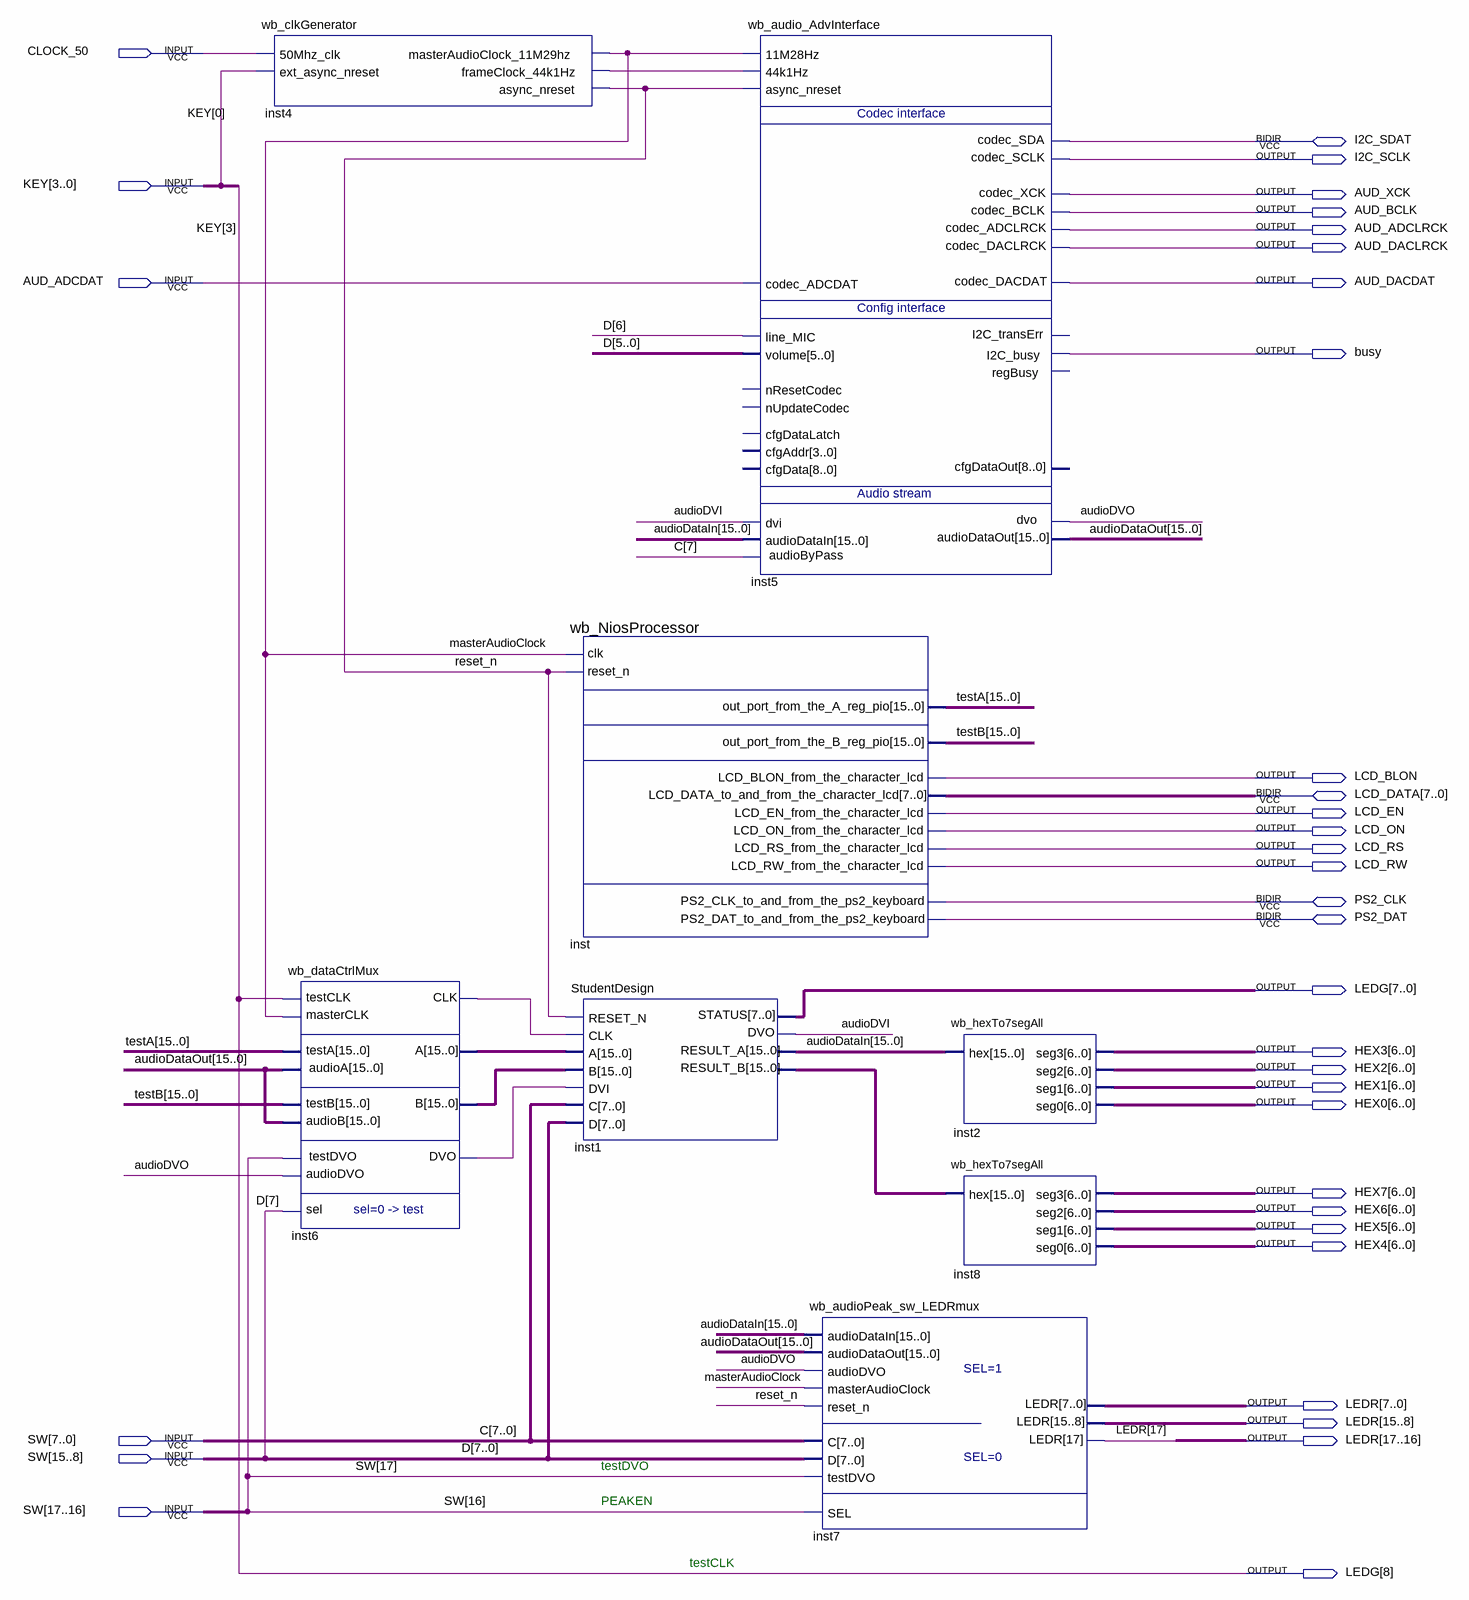
[diagram p0: schematic sheet]
// Quartus schematic Lab4.bdf as structural Verilog: 8 symbols, 35 pins
module Lab4 (
  input  CLOCK_50,
  input  [3:0] KEY,
  input  AUD_ADCDAT,
  input  [17:0] SW,
  inout  I2C_SDAT,
  inout  [7:0] LCD_DATA,
  inout  PS2_CLK,
  inout  PS2_DAT,
  output I2C_SCLK,
  output AUD_XCK,
  output AUD_BCLK,
  output AUD_ADCLRCK,
  output AUD_DACLRCK,
  output AUD_DACDAT,
  output busy,
  output LCD_BLON,
  output LCD_EN,
  output LCD_ON,
  output LCD_RS,
  output LCD_RW,
  output [8:0] LEDG,
  output [6:0] HEX3,
  output [6:0] HEX2,
  output [6:0] HEX1,
  output [6:0] HEX0,
  output [6:0] HEX7,
  output [6:0] HEX6,
  output [6:0] HEX5,
  output [6:0] HEX4,
  output [17:0] LEDR
);

  wire audioDVI, audioDVO, inst4_frameclock_44k1hz, inst6_clk, inst6_dvo, masterAudioClock, reset_n;
  wire [15:0] audioDataIn, audioDataOut, inst1_result_b, inst6_a, inst6_b, testA, testB;

  wb_clkGenerator inst4 (
    .\50Mhz_clk (CLOCK_50), .ext_async_nreset(KEY[0]), .frameClock_44k1Hz(inst4_frameclock_44k1hz),
    .masterAudioClock_11M29hz(masterAudioClock), .async_nreset(reset_n));
  wb_dataCtrlMux inst6 (
    .masterCLK(masterAudioClock), .audioA(audioDataOut), .testA(testA), .audioB(audioDataOut), .testB(testB),
    .testDVO(SW[17]), .sel(SW[15]), .testCLK(KEY[3]), .audioDVO(audioDVO), .CLK(inst6_clk), .A(inst6_a),
    .B(inst6_b), .DVO(inst6_dvo));
  wb_NiosProcessor inst (
    .clk(masterAudioClock), .reset_n(reset_n), .out_port_from_the_A_reg_pio(testA),
    .out_port_from_the_B_reg_pio(testB), .LCD_BLON_from_the_character_lcd(LCD_BLON),
    .LCD_EN_from_the_character_lcd(LCD_EN), .LCD_ON_from_the_character_lcd(LCD_ON),
    .LCD_RS_from_the_character_lcd(LCD_RS), .LCD_RW_from_the_character_lcd(LCD_RW),
    .LCD_DATA_to_and_from_the_character_lcd(LCD_DATA), .PS2_CLK_to_and_from_the_ps2_keyboard(PS2_CLK),
    .PS2_DAT_to_and_from_the_ps2_keyboard(PS2_DAT));
  StudentDesign inst1 (
    .A(inst6_a), .B(inst6_b), .C(SW[7:0]), .D(SW[15:8]), .CLK(inst6_clk), .RESET_N(reset_n), .DVI(inst6_dvo),
    .RESULT_A(audioDataIn), .RESULT_B(inst1_result_b), .STATUS(LEDG[7:0]), .DVO(audioDVI));
  wb_audio_AdvInterface inst5 (
    .\11M28Hz (masterAudioClock), .\44k1Hz (inst4_frameclock_44k1hz), .async_nreset(reset_n),
    .codec_ADCDAT(AUD_ADCDAT), .line_MIC(SW[14]), .volume(SW[13:8]), .dvi(audioDVI),
    .audioDataIn(audioDataIn), .audioByPass(SW[7]), .codec_XCK(AUD_XCK), .codec_SDA(I2C_SDAT),
    .codec_SCLK(I2C_SCLK), .codec_BCLK(AUD_BCLK), .codec_ADCLRCK(AUD_ADCLRCK), .codec_DACLRCK(AUD_DACLRCK),
    .codec_DACDAT(AUD_DACDAT), .I2C_busy(busy), .dvo(audioDVO), .audioDataOut(audioDataOut));  // open: nResetCodec, nUpdateCodec, cfgDataLatch, cfgAddr, cfgData, I2C_transErr, regBusy, cfgDataOut
  wb_audioPeak_sw_LEDRmux inst7 (
    .audioDataIn(audioDataIn), .audioDataOut(audioDataOut), .masterAudioClock(masterAudioClock),
    .reset_n(reset_n), .C(SW[7:0]), .D(SW[15:8]), .testDVO(SW[17]), .SEL(SW[16]), .audioDVO(audioDVO),
    .LEDR({LEDR[17], LEDR[15:0]}));
  wb_hexTo7segAll inst2 (.hex(audioDataIn), .seg3(HEX3), .seg2(HEX2), .seg1(HEX1), .seg0(HEX0));
  wb_hexTo7segAll inst8 (.hex(inst1_result_b), .seg3(HEX7), .seg2(HEX6), .seg1(HEX5), .seg0(HEX4));

  assign LEDG[8] = KEY[3];

  // Other names for the same wires on the sheet: C[7:0] = SW[7:0]; D[7:0] = SW[15:8]

  // Notes on the sheet:
  //   testDVO
  //   PEAKEN
  //   testCLK
endmodule
